# Altium schematic sheet PLC - Gas water - sensor detector-sheet-v2_2021-12-08.schdoc
size 302 x 165 mm
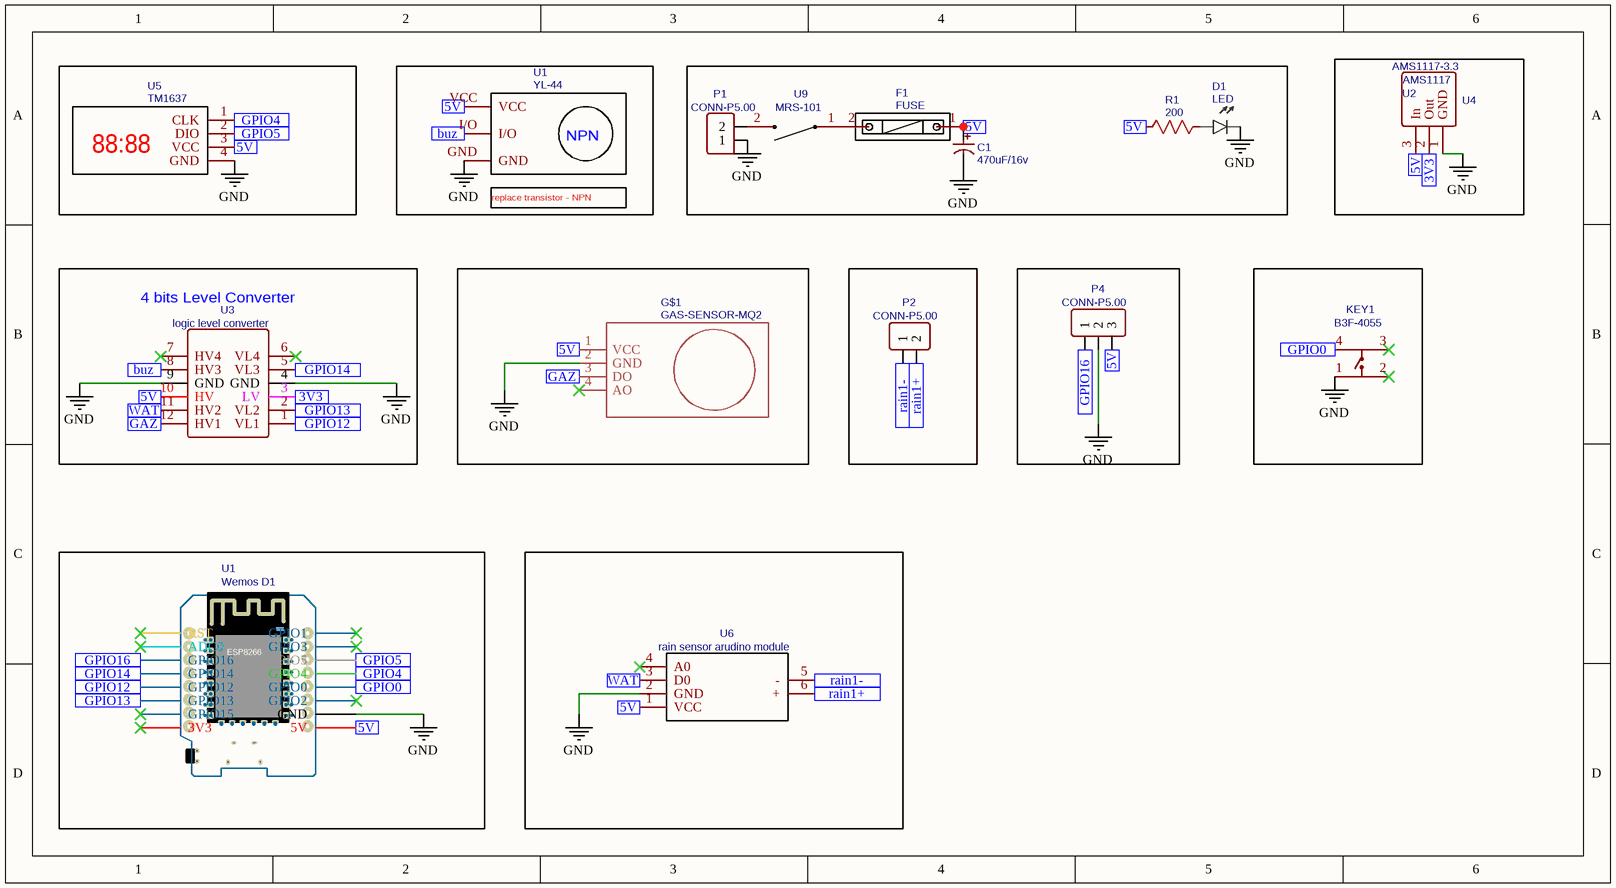
[diagram p0: PLC - Gas water - sensor detector-sheet-v2_2021-12-08.schdoc]

## Parts
C1  470uF/16v  [CAP-TH_BD8.0-P3.50-D1.0-FD]
D1  LED  [LED - 5MM]
F1  FUSE  [5X20-BLX-A]
G$1  GAS-SENSOR-MQ2  [GAS-SENSOR-MQ2]
KEY1  B3F-4055  [KEY-TH_4P-L12.0-W12.0-P5.00-LS13.4-EH]
P1  CONN-P5.00  [CONN-TH_2P-P5.00]
P2  CONN-P5.00  [CONN-TH_2P-P5.00]
P4  CONN-P5.00  [CONN-TH_3P-P5.08]
R1  200  [R-0.5W]
U1  YL-44  [YL-44 BUZZER MODULE - PCB]
U2  WEMOS_D1_MINI  [WEMOS]  (value not drawn)
U3  logic level converter  [4BITS_LOGIC_LEVEL_CONVERTER_BIDIRECTIONAL_5V_33V-10MM]
U4  AMS1117-3.3  [AMS1117-3.3 FIXED]
U5  TM1637  [TM1637-PCB]
U6  rain sensor arudino module  [RAIN SENSOR ARUDINO MODULE PCB]
U9  MRS-101  [MRS-101 SWITCH PCB]

## Blocks framed on the sheet
NPN: U1

## Ports
3V3 (in), 5V (in), buz (in), GAZ (in), GPIO0 (in), GPIO4 (in), GPIO5 (in), GPIO12 (in), GPIO13 (in), GPIO14 (in), GPIO16 (in), rain1+ (in), rain1- (in), WAT (in)

## Nets
GND: C1.2 D1.2(-) G$1.2(GND) KEY1.1 P1.1 P4.2 U1.GND U2.GND U3.4(GND) U3.9(GND) U4.1(GND) U5.4(GND) U6.2(GND)
3V3: U3.3(LV) U4.2(Out) ; port 3V3
5V: C1.1 F1.1 G$1.1(VCC) P4.3 R1.2 U1.VCC U2.5V U3.10(HV) U4.3(In) U5.3(VCC) U6.1(VCC) ; port 5V
buz: U1.I/O U3.8(HV3) ; port buz
GAZ: G$1.3(DO) U3.12(HV1) ; port GAZ
GPIO0: KEY1.4 U2.D3(GPIO0) ; port GPIO0
GPIO4: U2.D2(GPIO4) U5.1(CLK) ; port GPIO4
GPIO5: U2.D1(GPIO5) U5.2(DIO) ; port GPIO5
GPIO12: U2.D6(GPIO12) U3.1(VL1) ; port GPIO12
GPIO13: U2.D7(GPIO13) U3.2(VL2) ; port GPIO13
GPIO14: U2.D5(GPIO14) U3.5(VL3) ; port GPIO14
GPIO16: P4.1 U2.D0(GPIO16) ; port GPIO16
rain1+: P2.2 U6.6(+) ; port rain1+
rain1-: P2.1 U6.5(-) ; port rain1-
WAT: U3.11(HV2) U6.3(D0) ; port WAT
NetD1_1: D1.1(+) R1.1
NetF1_2: F1.2 U9.1(in)
NetP1_2: P1.2 U9.2

Not connected (* = marked no-connect by the designer): G$1 4(AO)*; KEY1 2* 3*; U2 3V3* A0(ADC0)* D4(GPIO2)* D8(GPIO15)* RST* RX(GPIO3)* TX(GPIO1)*; U3 6(VL4)* 7(HV4)*; U6 4(A0)*

## Notes on the sheet
- (near U1) replace transistor - NPN
- (in symbol AMS1117-3.3) AMS1117; U2
- (in symbol logic level converter) 4 bits Level Converter
- (in symbol TM1637) 88:88
- (in symbol WEMOS_D1_MINI) U1; Wemos D1; ESP8266; G; RESET; D1 mini; Wemos

## Library data of the parts
C1 = 470uF/16v: BOM_Manufacturer: ValuePro; BOM_Manufacturer Part: 250V 4.7uF 8X12; nameAlias: Capacitance; BOM_Supplier: LCSC; BOM_Supplier Part: C2775; spicePre: C; spiceSymbolName: 250V 4.7uF 8X12
D1 = LED: BOM_Manufacturer Part: G502DC; description: DIP LED Green-Green; Contributor: glove; spicePre: D
F1 = FUSE: BOM_Manufacturer Part: 5x20 BLX-Atype Fuse holder XC-7; BOM_Manufacturer: XCFuse; Contributor: LCSC; BOM_Supplier: LCSC; image: //image.lceda.cn/szlcsc/C3131.jpg; BOM_Supplier Part: C3131; spicePre: F
G$1 = GAS-SENSOR-MQ2: Contributor: Klaus-Peter Ludwig; spicePre: G; spiceSymbolName: GAS-SENSOR-MQ2
KEY1 = B3F-4055: BOM_Manufacturer: OMRON; BOM_Supplier: LCSC; BOM_Manufacturer Part: B3F-4055; BOM_Supplier Part: C84931; spicePre: K; spiceSymbolName: B3F-4055
P1 P2 P4 = CONN-P5.00: Contributor: LCEDA_Lib; BOM_Supplier: LCSC; spicePre: P
  P1 P2: spiceSymbolName: CONN-TH_2P-P5.00
  P4: spiceSymbolName: CONN-TH_3P-P5.00
R1 = 200: Contributor: lipsneck; spicePre: R
U1 = YL-44: Contributor: giggi.ganz; BOM_Manufacturer Part: YL-44; spicePre: U; spiceSymbolName: YL-44
U2 = WEMOS_D1_MINI: Contributor: narin; spicePre: U
U3 = logic level converter: BOM_Manufacturer Part: 4bits_Logic_Level_Converter_Module_Bi_Directional_5V_33V; Contributor: SPACE FUSION; link: https://goo.gl/xLxZu8; BOM_Supplier: https://www.sparkfun.com/products/12009; spicePre: U; spiceSymbolName: 4BITS_LOGIC_LEVEL_CONVERTER_MODULE_BI_DIRECTIONAL_5V_33V COPY
U4 = AMS1117-3.3: Contributor: coolascats “coolascats”; BOM_Supplier Part: undefined; spicePre: U; spiceSymbolName: AMS1117-3.3_Module
U5 = TM1637: Contributor: ahmad2ghafari; BOM_Manufacturer Part: TM1637; spicePre: U; spiceSymbolName: TM1637
U6 = rain sensor arudino module: BOM_Manufacturer: Flying Fish; Contributor: smartkreshuk; link: https://www.instructables.com/id/Arduino-Modules-Rain-Sensor/; spicePre: U; spiceSymbolName: rain sensor arudino module
U9 = MRS-101: Contributor: smartkreshuk; BOM_Manufacturer Part: MRS-101; link: https://static.chipdip.ru/lib/955/DOC002955067.pdf; spicePre: U